# EAGLE schematic BLE Bee v1.0 sch (EAGLE 6.4)
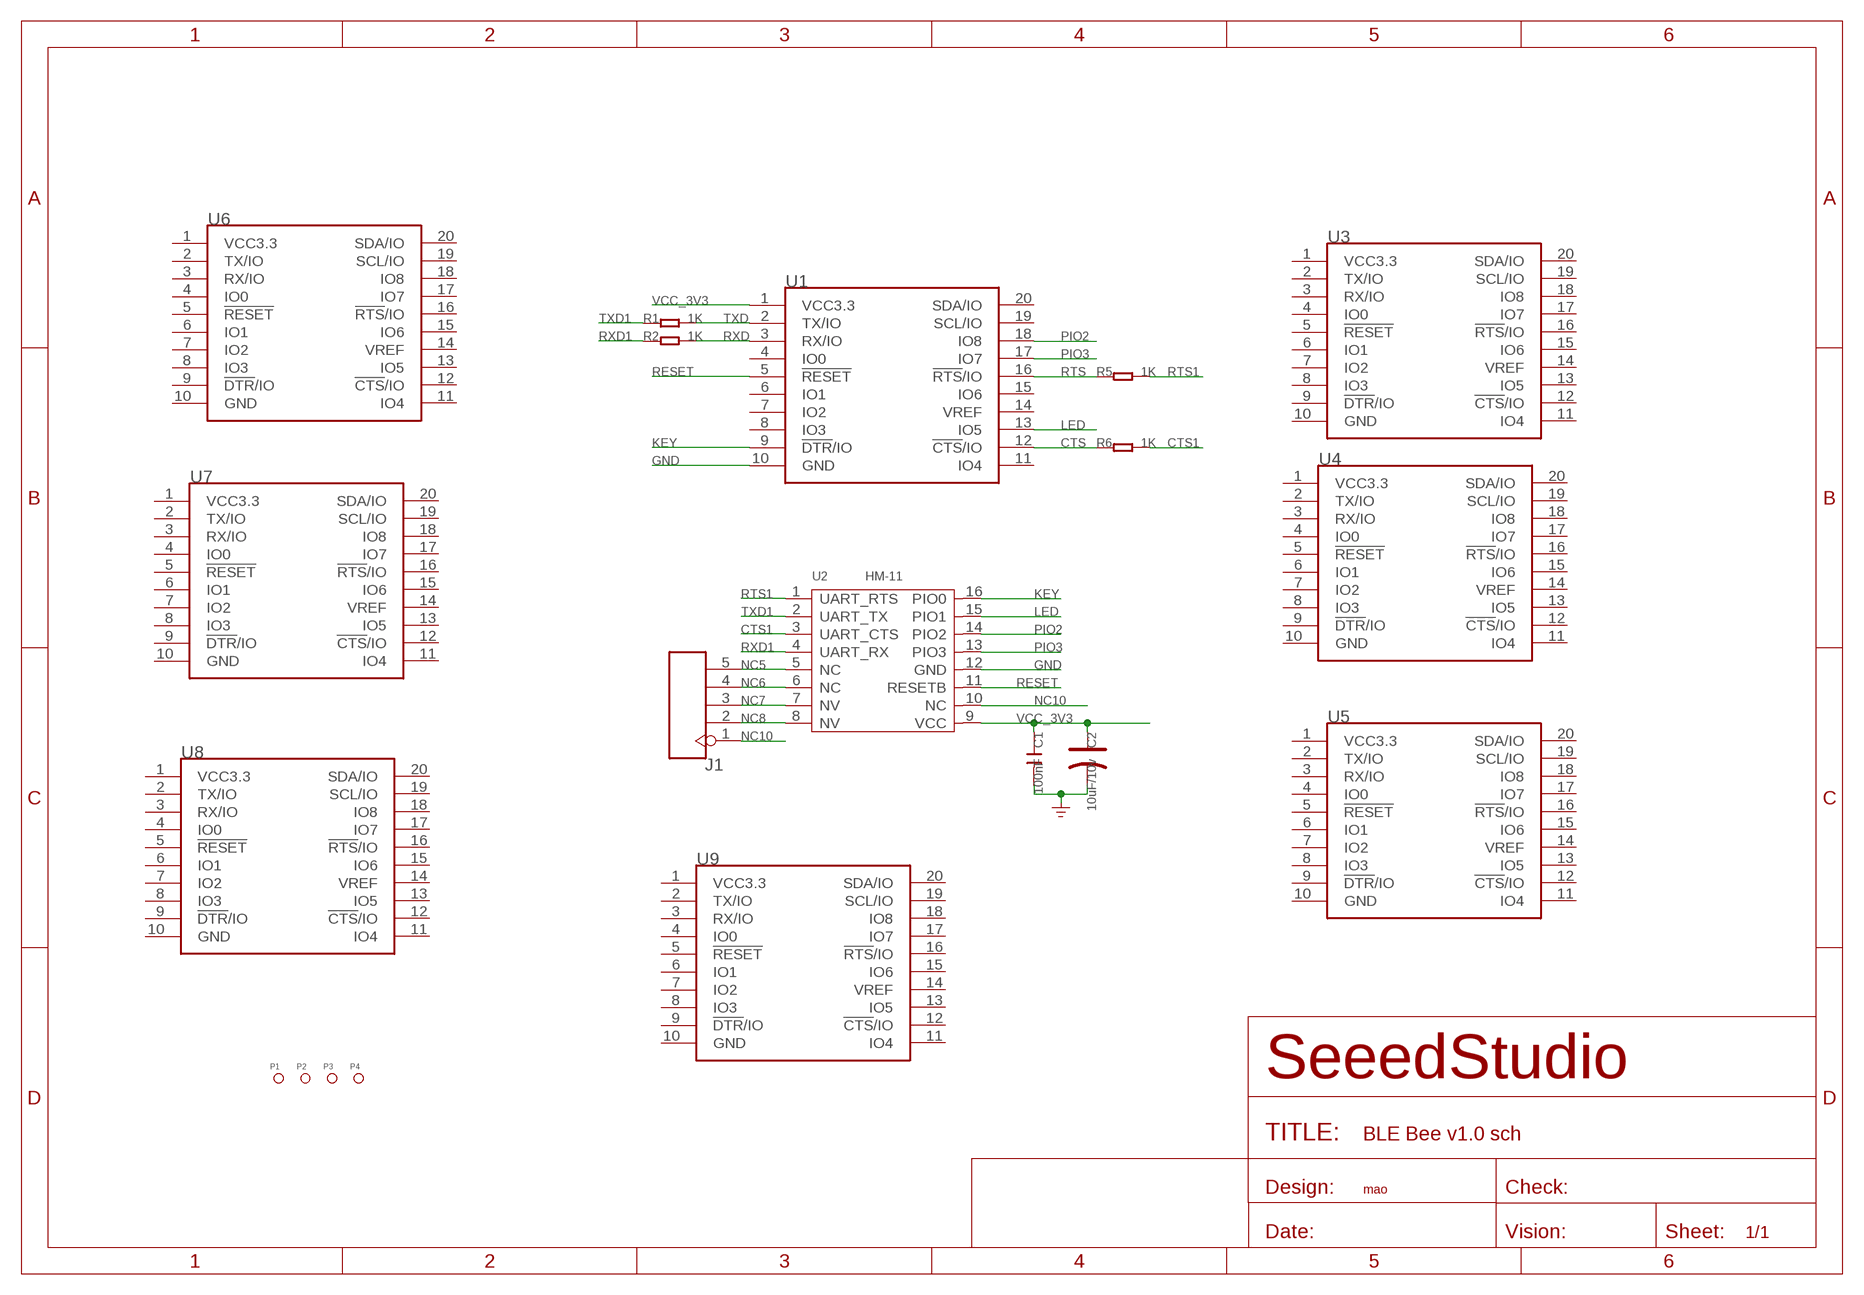
[diagram p0: schematic, sheet 1]

## Parts
C1  100nF  C-0603  [C0603]
C2  10uF/10v  CAP-AVX-A  [AVX-A]
J1  HEADER-5P-2.0  [5P-2.0]
P1  PAD-MARK  [ROUND-MARK-1.0]
P2  PAD-MARK  [ROUND-MARK-1.0]
P3  PAD-MARK  [ROUND-MARK-1.0]
P4  PAD-MARK  [ROUND-MARK-1.0]
R1  1K  R-0603  [R0603]
R2  1K  R-0603  [R0603]
R5  1K  R-0603  [R0603]
R6  1K  R-0603  [R0603]
U1  BEE-OPENBEE-DIP  [20P-DIP-2.0]
U2  HM-11  [16P-18.5X13.5X0.8]
U3  BEE-OPENBEE-DIP  [20P-DIP-2.0]
U4  BEE-OPENBEE-DIP  [20P-DIP-2.0]
U5  BEE-OPENBEE-DIP  [20P-DIP-2.0]
U6  BEE-OPENBEE-DIP  [20P-DIP-2.0]
U7  BEE-OPENBEE-DIP  [20P-DIP-2.0]
U8  BEE-OPENBEE-DIP  [20P-DIP-2.0]
U9  BEE-OPENBEE-DIP  [20P-DIP-2.0]

## Nets
CTS: R6.1 U1.12(!CTS!/IO)
CTS1: R6.2 U2.3(UART_CTS)
GND: C1.2 C2.- U1.10(GND) U2.12(GND)
KEY: U1.9(!DTR!/IO) U2.16(PIO0)
LED: U1.13(IO5) U2.15(PIO1)
NC5: J1.5 U2.5(NC)
NC6: J1.4 U2.6(NC)
NC7: J1.3 U2.7(NV)
NC8: J1.2 U2.8(NV)
NC10: J1.1 U2.10(NC)
PIO2: U1.18(IO8) U2.14(PIO2)
PIO3: U1.17(IO7) U2.13(PIO3)
RESET: U1.5(!RESET) U2.11(RESETB)
RTS: R5.1 U1.16(!RTS!/IO)
RTS1: R5.2 U2.1(UART_RTS)
RXD: R2.2 U1.3(RX/IO)
RXD1: R2.1 U2.4(UART_RX)
TXD: R1.2 U1.2(TX/IO)
TXD1: R1.1 U2.2(UART_TX)
VCC_3V3: C1.1 C2.+ U1.1(VCC3.3) U2.9(VCC)
Unconnected: U1.4(IO0) U1.6(IO1) U1.7(IO2) U1.8(IO3) U1.11(IO4) U1.14(VREF) U1.15(IO6) U1.19(SCL/IO) U1.20(SDA/IO) U3.1(VCC3.3) U3.2(TX/IO) U3.3(RX/IO) U3.4(IO0) U3.5(!RESET) U3.6(IO1) U3.7(IO2) U3.8(IO3) U3.9(!DTR!/IO) U3.10(GND) U3.11(IO4) U3.12(!CTS!/IO) U3.13(IO5) U3.14(VREF) U3.15(IO6) U3.16(!RTS!/IO) U3.17(IO7) U3.18(IO8) U3.19(SCL/IO) U3.20(SDA/IO) U4.1(VCC3.3) U4.2(TX/IO) U4.3(RX/IO) U4.4(IO0) U4.5(!RESET) U4.6(IO1) U4.7(IO2) U4.8(IO3) U4.9(!DTR!/IO) U4.10(GND) U4.11(IO4) U4.12(!CTS!/IO) U4.13(IO5) U4.14(VREF) U4.15(IO6) U4.16(!RTS!/IO) U4.17(IO7) U4.18(IO8) U4.19(SCL/IO) U4.20(SDA/IO) U5.1(VCC3.3) U5.2(TX/IO) U5.3(RX/IO) U5.4(IO0) U5.5(!RESET) U5.6(IO1) U5.7(IO2) U5.8(IO3) U5.9(!DTR!/IO) U5.10(GND) U5.11(IO4) U5.12(!CTS!/IO) U5.13(IO5) U5.14(VREF) U5.15(IO6) U5.16(!RTS!/IO) U5.17(IO7) U5.18(IO8) U5.19(SCL/IO) U5.20(SDA/IO) U6.1(VCC3.3) U6.2(TX/IO) U6.3(RX/IO) U6.4(IO0) U6.5(!RESET) U6.6(IO1) U6.7(IO2) U6.8(IO3) U6.9(!DTR!/IO) U6.10(GND) U6.11(IO4) U6.12(!CTS!/IO) U6.13(IO5) U6.14(VREF) U6.15(IO6) U6.16(!RTS!/IO) U6.17(IO7) U6.18(IO8) U6.19(SCL/IO) U6.20(SDA/IO) U7.1(VCC3.3) U7.2(TX/IO) U7.3(RX/IO) U7.4(IO0) U7.5(!RESET) U7.6(IO1) U7.7(IO2) U7.8(IO3) U7.9(!DTR!/IO) U7.10(GND) U7.11(IO4) U7.12(!CTS!/IO) U7.13(IO5) U7.14(VREF) U7.15(IO6) U7.16(!RTS!/IO) U7.17(IO7) U7.18(IO8) U7.19(SCL/IO) U7.20(SDA/IO) U8.1(VCC3.3) U8.2(TX/IO) U8.3(RX/IO) U8.4(IO0) U8.5(!RESET) U8.6(IO1) U8.7(IO2) U8.8(IO3) U8.9(!DTR!/IO) U8.10(GND) U8.11(IO4) U8.12(!CTS!/IO) U8.13(IO5) U8.14(VREF) U8.15(IO6) U8.16(!RTS!/IO) U8.17(IO7) U8.18(IO8) U8.19(SCL/IO) U8.20(SDA/IO) U9.1(VCC3.3) U9.2(TX/IO) U9.3(RX/IO) U9.4(IO0) U9.5(!RESET) U9.6(IO1) U9.7(IO2) U9.8(IO3) U9.9(!DTR!/IO) U9.10(GND) U9.11(IO4) U9.12(!CTS!/IO) U9.13(IO5) U9.14(VREF) U9.15(IO6) U9.16(!RTS!/IO) U9.17(IO7) U9.18(IO8) U9.19(SCL/IO) U9.20(SDA/IO)

## Notes on the sheet
- mao

## Library data of the parts
C1 = Discrete:C*: Ceramic Capacitors
C2 = Discrete:CAP*: Electrolytic Capacitors,Tantalum Capacitors and Super Capacitors
J1 = Connector :HEADER-5P
P1-P4 = Discrete:PAD-MARK; PARTNO: DNP
R1 R2 R5 R6 = Discrete:R*
U1 U3-U9 = moudle:BEE-OPENBEE
U2 = template:HM-11: Bluetooth Specification V4.0 BLE

## Net classes
0 default: width 0.152 mm, drill 0.305 mm, clearance 0.152 mm